# Altium schematic sheet ETH-PHY.SchDoc: RFSOC SAWG
size 420 x 297 mm; Author: G.Kasprowicz; CompanyName: WUT ISE; DrawnBy: G.Kasprowicz; Organization: WUT ISE; Address1: PW ISE; Address2: Nowowiejska 15/19 00-665 Warsaw; Address3: gkasprow@gmail.com; Revision: 1; SheetNumber: 2; SheetTotal: 4; ModifiedBy: -; CheckedDate: -; Title2: ETH-PHY; DivGrp: WUT ISE; Designer: G.Kasprowicz; ModifiedDate: -; ProjectName: Sensor Box
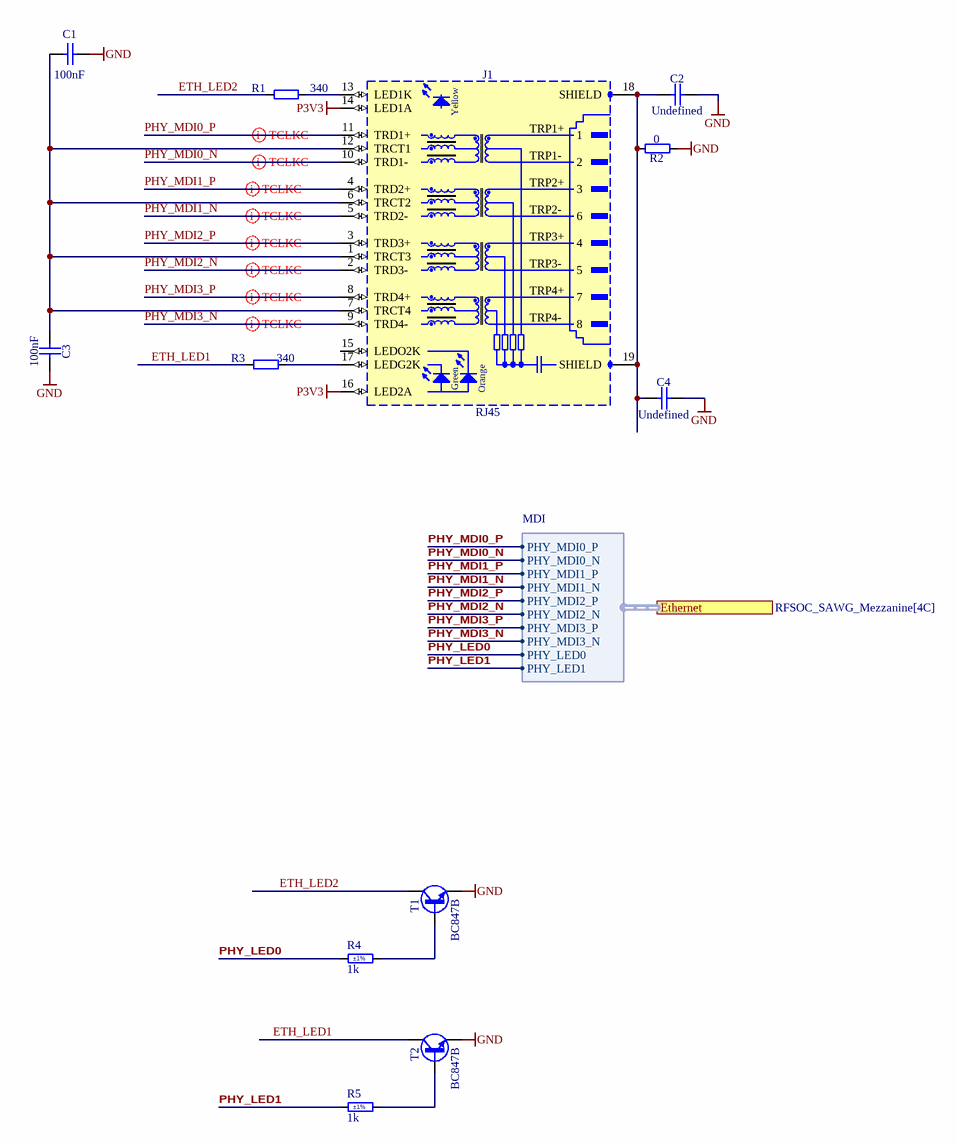
[diagram p0: ETH-PHY.SchDoc]

## Parts
C1  100nF  [CAPC1005X55N]
C2  Undefined  [CAPC1608X90N]
C3  100nF  [CAPC1005X55N]
C4  Undefined  [CAPC1608X90N]
J1  RJ45  [BEL_L829-1J1T-43]
R1  340  [RESC1608X55N]
R2  0  [RESC1005X40N]
R3  340  [RESC1608X55N]
R4  1k  Tolerance: ±1%  [RESC1005X40N]
R5  1k  Tolerance: ±1%  [RESC1005X40N]
T1  BC847B  [SOT95P230X110-3N]
T2  BC847B  [SOT95P230X110-3N]

## Ports
Ethernet (harness MDI, see RFSOC_SAWG_Mezzanine[4C])

## Harnesses
MDI: PHY_MDI0_N, PHY_MDI1_P, PHY_MDI1_N, PHY_MDI2_P, PHY_MDI2_N, PHY_MDI3_P, PHY_MDI3_N, PHY_LED0, PHY_LED1, PHY_MDI0_P

## Nets
GND: C1.2 C2.2 C3.1 C4.2 R2.1 T1.2(E) T2.2(E)
P3V3: J1.14(LED1A) J1.16(LED2A)
ETH_LED1: R3.1 T2.3(C)
ETH_LED2: R1.1 T1.3(C)
PHY_LED0: R4.1 ; port Ethernet.PHY_LED0
PHY_LED1: R5.1 ; port Ethernet.PHY_LED1
PHY_MDI0_N: J1.10(TRD1-) ; port Ethernet.PHY_MDI0_N
PHY_MDI0_P: J1.11(TRD1+) ; port Ethernet.PHY_MDI0_P
PHY_MDI1_N: J1.5(TRD2-) ; port Ethernet.PHY_MDI1_N
PHY_MDI1_P: J1.4(TRD2+) ; port Ethernet.PHY_MDI1_P
PHY_MDI2_N: J1.2(TRD3-) ; port Ethernet.PHY_MDI2_N
PHY_MDI2_P: J1.3(TRD3+) ; port Ethernet.PHY_MDI2_P
PHY_MDI3_N: J1.9(TRD4-) ; port Ethernet.PHY_MDI3_N
PHY_MDI3_P: J1.8(TRD4+) ; port Ethernet.PHY_MDI3_P
NetC1_1: C1.1 C3.2 J1.1(TRCT3) J1.6(TRCT2) J1.7(TRCT4) J1.12(TRCT1)
NetC2_1: C2.1 C4.1 J1.18(SHIELD) J1.19(SHIELD) R2.2
NetJ1_13: J1.13(LED1K) R1.2
NetJ1_17: J1.17(LEDG2K) R3.2
NetR4_2: R4.2 T1.1(B)
NetR5_2: R5.2 T2.1(B)

Not connected (* = marked no-connect by the designer): J1 15(LEDO2K)

## Layout directives
differential pair: PHY_MDI0_N, PHY_MDI0_P, PHY_MDI1_N, PHY_MDI1_P, PHY_MDI2_N, PHY_MDI2_P, PHY_MDI3_N, PHY_MDI3_P

## Notes on the sheet
- Project/Equipment
- Document
- Designer
- Drawn by
- Check.by
- Copyright WUT ISE 2020.
  This documentation describes Open Hardware and is licensed under the CERN OHL v.1.2. You may redistribute and modify this documentation under the terms of the CERN OHL v.1.2. (http://ohwr.org/CERNOHL). This documentation is distributed WITHOUT ANY EXPRESS OR IMPLIED WARRANTY, INCLUDING OF MERCHANTABILITY, SATISFACTORY QUALITY AND FITNESS FOR A PARTICULAR PURPOSE. Please see the CERN OHL v.1.2 for applicable conditions.
- Contact
- File
- Last Mod.
- Print Date
- Sheet
- Size
- A3
- of
- Rev
- (in symbol BELFUSE_L829-1J1T-43) Yellow; TRP1+; TRP1-; TRP2+; TRP2-; TRP3+; TRP3-; TRP4+; TRP4-; Green; Orange

## Library data of the parts
C1 C3 = CC0402_100NF_16V_10%_X5R: Non-polarised capacitor; Part Description: SMD Multilayer Chip Ceramic Capacitor; Manufacturer: GENERIC; Manufacturer1 Part Number: GRM155R61C104KA88D; Voltage: 16V; TC: X5R; Tolerance: ±10%; Value: 100nF; Part Number: CC0402_100NF_16V_10%_X5R; Component Kind: Standard; Component Type: Standard; Pin Count: 2; Status: None; Manufacturer Part Number: CC0402_100NF_16V_10%_X5R; Case: 0402; Mounted: Yes; Socket: No; SMD: Yes; Sense: No; Manufacturer1 Example: MURATA; Manufacturer1 ComponentHeight: 0.55mm; HelpURL: \\cern.ch\dfs\Applications\Altium\Datasheets\CC0402_X5R_MURATA_GRM.pdf; Author: CERN DEM JLC
  C1: CreateDate: 10/12/2013; LatestRevisionDate: 10/12/2013
  C3: CreateDate: 10.12.2013; LatestRevisionDate: 10.12.2013
C2 C4 = CC0603_NO-VALUE: Non-polarised capacitor; Part Description: Reserved Footprint For 0603(1608) Chip Ceramic Capacitor; Mounted: No; Part Number: CC0603_NO-VALUE; Component Kind: Standard; Component Type: Standard; Pin Count: 2; Value: Undefined; Status: None; Manufacturer: Undefined; Manufacturer Part Number: CC0603_NO-VALUE; Case: 0603; Socket: No; SMD: Yes; Sense: No; Manufacturer1 ComponentHeight: 0.9mm; HelpURL: Undefined; Author: CERN DEM MR; CreateDate: 22.11.2016; LatestRevisionDate: 22.11.2016
J1 = BELFUSE_L829-1J1T-43: 1 Port, RJ45, Gigabit Ethernet, MagJack Connector Module With Yellow And Green/Orange LEDs; Part Description: 1 Port, Yellow/ Green-Orange LEDs,  RJ45 10/100/1000 Gigabit Ethernet, MagJack® Connector Module; Manufacturer: BEL MAGNETIC SOLUTIONS; PressFit: No; Part Number: BELFUSE_L829-1J1T-43; Component Kind: Standard; Component Type: Standard; Pin Count: 19; Family: RJ45; Mounted: Yes; Socket: No; SMD: No; Sense: No; Status: None; Manufacturer Part Number: L829-1J1T-43; ComponentHeight: 13.3mm; HelpURL: \\cern.ch\dfs\Applications\Altium\Datasheets\BEL_L829-1J1T-43.pdf; Author: CERN DEM JLC; CreateDate: 22.08.2011; LatestRevisionDate: 20.09.2018
R1 R3 = R0603_340R_0.1%_0.063W_10PPM: Resistor - 0.1%; Part Description: Thin Film Chip Resistor; Manufacturer: GENERIC; Manufacturer1 Part Number: RN73C1J340RBTDF; Power: 0.063W; TC: ±10ppm; PressFit: No; Part Number: R0603_340R_0.1%_0.063W_10PPM; Component Kind: Standard; Component Type: Standard; Pin Count: 2; Value: 340; Status: Not Recommended; Tolerance: ±0.1%; Manufacturer Part Number: R0603_340R_0.1%_0.063W_10PPM; Case: 0603; Mounted: Yes; Sense: No; Socket: No; SMD: Yes; Manufacturer1 Example: TYCO HOLSWORTHY; Manufacturer1 ComponentHeight: 0.5mm; HelpURL: \\cern.ch\dfs\Applications\Altium\Datasheets\R0603_Tyco_RN73.pdf; Author: CERN DEM JLC; CreateDate: 03.12.2007; LatestRevisionDate: 13.03.2008
R2 = R0402_0R_JUMPER: Resistor; Part Description: 1A (0.05R Max DC Resistance) Zero Ohm Jumper; Manufacturer: GENERIC; Manufacturer1 Part Number: 232270591001L; PressFit: No; Part Number: R0402_0R_JUMPER; Component Kind: Standard; Component Type: Standard; Pin Count: 2; Value: 0; Status: Not Recommended; Manufacturer Part Number: R0402_0R_JUMPER; Case: 0402; Mounted: Yes; Sense: No; Socket: No; SMD: Yes; Manufacturer1 Example: YAGEO PHYCOMP; Manufacturer1 ComponentHeight: 0.4mm; HelpURL: \\cern.ch\dfs\Applications\Altium\Datasheets\R0402_Phycomp_RC0402.pdf; Author: CERN DEM JLC; CreateDate: 03/12/2007; LatestRevisionDate: 17/10/2012
R4 R5 = R0402_1K_1%_0.0625W_100PPM: Resistor - 1%; Part Description: General Purpose Thick Film Chip Resistor; Manufacturer: GENERIC; Manufacturer1 Part Number: 232270671002L; TC: ±100ppm/°C; PressFit: No; Case: 0402; Value: 1k; Part Number: R0402_1K_1%_0.0625W_100PPM; Component Kind: Standard; Component Type: Standard; Pin Count: 2; Status: Not Recommended; Power: 0.0625W; Manufacturer Part Number: R0402_1K_1%_0.0625W_100PPM; Mounted: Yes; Sense: No; Socket: No; SMD: Yes; Manufacturer1 Example: YAGEO PHYCOMP; Manufacturer1 ComponentHeight: 0.4mm; HelpURL: \\cern.ch\dfs\Applications\Altium\Datasheets\R0402_Phycomp_RC0402.pdf; Author: CERN DEM JLC; CreateDate: 03.12.2007; LatestRevisionDate: 17.10.2012
T1 T2 = BC847B: NPN Transistor; Part Description: 45V 100mA NPN General-Purpose Transistor; Manufacturer: NXP SEMICONDUCTORS; PressFit: No; Bonding: No; Part Number: BC847B; Component Kind: Standard; Component Type: Standard; Device: BC847B; PackageDescription: SOT23, 0.95mm Pitch; 3 Pin, 1.30mm W X 2.90mm L X 1.10mm H body, IPC Medium Density; Manufacturer Part Number: BC847B; Pin Count: 3; Case: SOT23-3; Mounted: Yes; Socket: No; SMD: Yes; Sense: No; ComponentHeight: 1.1mm; HelpURL: \\cern.ch\dfs\Applications\Altium\Datasheets\BC847B.pdf; Author: CERN DEM JLC; CreateDate: 14.06.2011; LatestRevisionDate: 14.06.2011